# Altium schematic sheet ADC.SchDoc
size A4; SheetNumber: 4; SheetTotal: 5
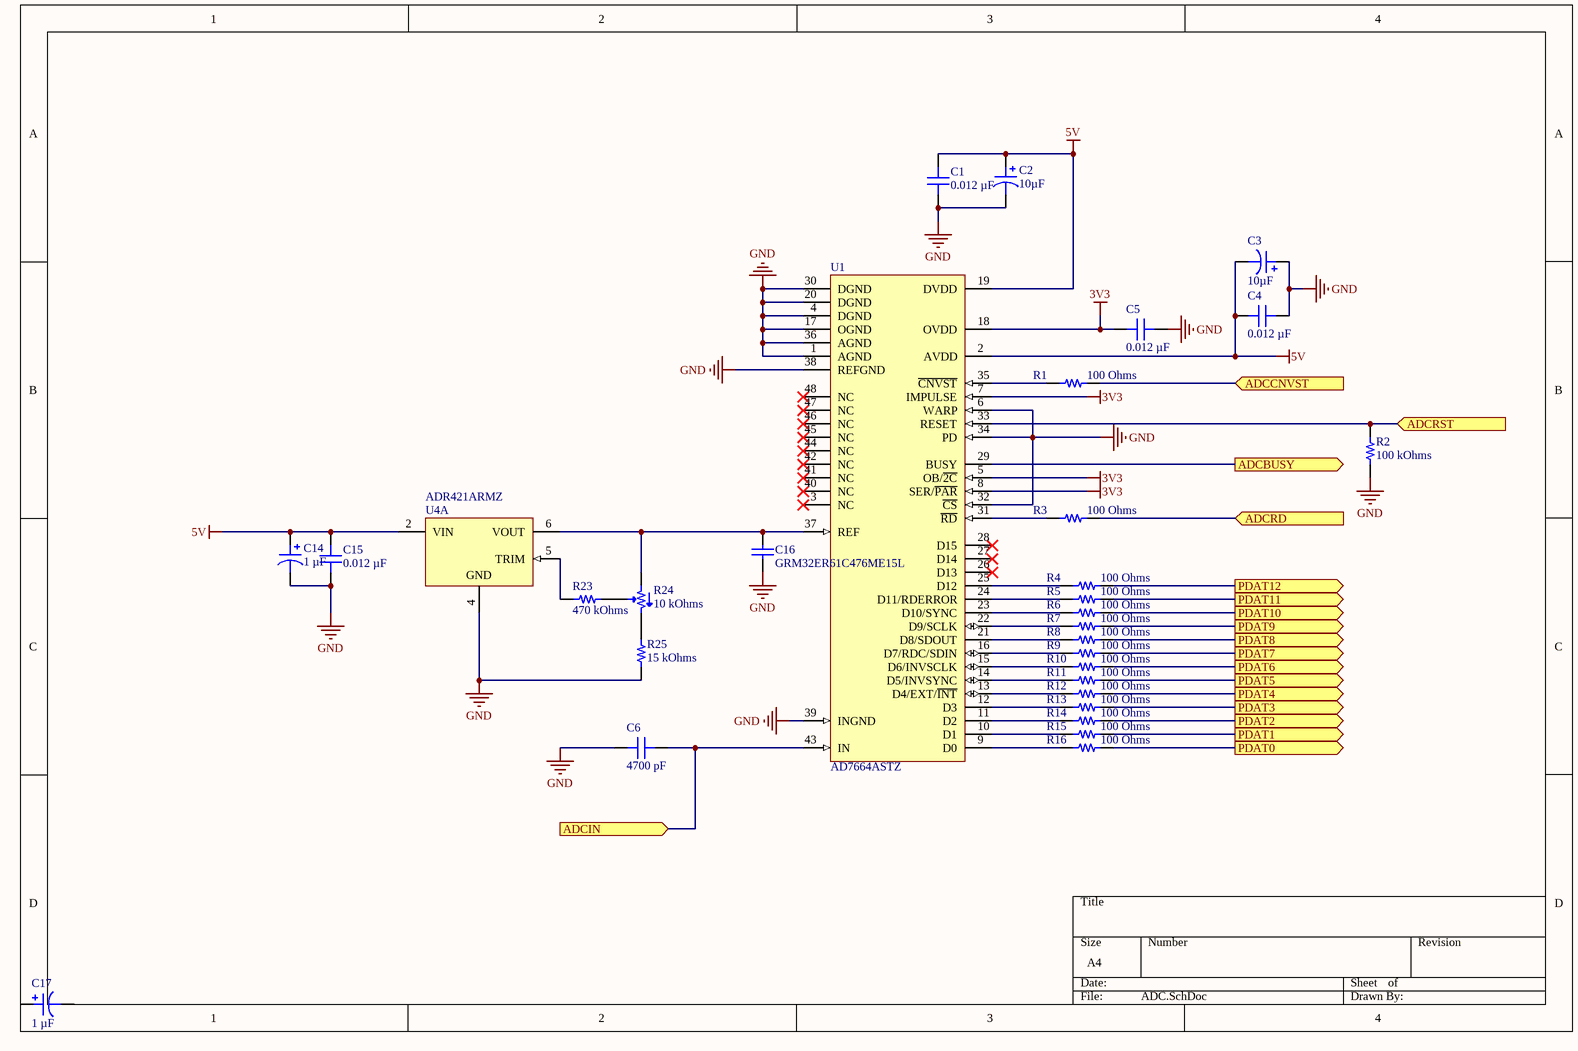
[diagram p0: ADC.SchDoc]

## Parts
C1  0.012 µF  [CAP 0603_1608]
C2  10µF  [CAP ALSMD POLY 4.3MM H5.5MM]
C3  10µF  [CAP ALSMD POLY 4.3MM H5.5MM]
C4  0.012 µF  [CAP 0603_1608]
C5  0.012 µF  [CAP 0603_1608]
C6  4700 pF  [CAP 0603_1608]
C14  1 µF  [CAP ALSMD 4.3MM H5.4MM]
C15  0.012 µF  [CAP 0603_1608]
C16  GRM32ER61C476ME15L  [MURA-1210_H_2.7_M]
C17  1 µF  [CAP ALSMD 4.3MM H5.4MM]
R1  100 Ohms  [RES 0603_1608]
R2  100 kOhms  [RES 0603_1608]
R3  100 Ohms  [RES 0603_1608]
R4  100 Ohms  [RES 0603_1608]
R5  100 Ohms  [RES 0603_1608]
R6  100 Ohms  [RES 0603_1608]
R7  100 Ohms  [RES 0603_1608]
R8  100 Ohms  [RES 0603_1608]
R9  100 Ohms  [RES 0603_1608]
R10  100 Ohms  [RES 0603_1608]
R11  100 Ohms  [RES 0603_1608]
R12  100 Ohms  [RES 0603_1608]
R13  100 Ohms  [RES 0603_1608]
R14  100 Ohms  [RES 0603_1608]
R15  100 Ohms  [RES 0603_1608]
R16  100 Ohms  [RES 0603_1608]
R23  470 kOhms  [RES 0603_1608]
R24  10 kOhms  [POT BOURNS TRIMPOT TC33]
R25  15 kOhms  [RES 0603_1608]
U1  AD7664ASTZ  [ST-48_N]
U4  ADR421ARMZ  [ADI-RM-8_N]  (part A of 2)

## Ports
ADCBUSY (out), ADCCNVST (in), ADCIN (in), ADCRD (in), ADCRST (in), PDAT0 (out), PDAT1 (out), PDAT2 (out), PDAT3 (out), PDAT4 (out), PDAT5 (out), PDAT6 (out), PDAT7 (out), PDAT8 (out), PDAT9 (out), PDAT10 (out), PDAT11 (out), PDAT12 (out)

## Nets
3V3: C5.2 U1.5(OB/~{2C}) U1.7(IMPULSE) U1.8(SER/~{PAR}) U1.18(OVDD)
5V: C1.2 C2.1 C3.2 C4.2 C14.1 C15.2 U1.2(AVDD) U1.19(DVDD) U4.2(VIN)
GND: C1.1 C2.2 C3.1 C4.1 C5.1 C6.1 C14.2 C15.1 C16.1 R2.1 R25.1 U1.1(AGND) U1.4(DGND) U1.6(WARP) U1.17(OGND) U1.20(DGND) U1.30(DGND) U1.32(~{CS}) U1.34(PD) U1.36(AGND) U1.38(REFGND) U1.39(INGND) U4.4(GND)
ADCBUSY: U1.29(BUSY) ; port ADCBUSY
ADCCNVST: R1.2 ; port ADCCNVST
ADCIN: C6.2 U1.43(IN) ; port ADCIN
ADCRD: R3.2 ; port ADCRD
ADCRST: R2.2 U1.33(RESET) ; port ADCRST
PDAT0: R16.2 ; port PDAT0
PDAT1: R15.2 ; port PDAT1
PDAT2: R14.2 ; port PDAT2
PDAT3: R13.2 ; port PDAT3
PDAT4: R12.2 ; port PDAT4
PDAT5: R11.2 ; port PDAT5
PDAT6: R10.2 ; port PDAT6
PDAT7: R9.2 ; port PDAT7
PDAT8: R8.2 ; port PDAT8
PDAT9: R7.2 ; port PDAT9
PDAT10: R6.2 ; port PDAT10
PDAT11: R5.2 ; port PDAT11
PDAT12: R4.2 ; port PDAT12
NetC16_2: C16.2 R24.1 U1.37(REF) U4.6(VOUT)
NetR1_1: R1.1 U1.35(~{CNVST})
NetR3_1: R3.1 U1.31(~{RD})
NetR4_1: R4.1 U1.25(D12)
NetR5_1: R5.1 U1.24(D11/RDERROR)
NetR6_1: R6.1 U1.23(D10/SYNC)
NetR7_1: R7.1 U1.22(D9/SCLK)
NetR8_1: R8.1 U1.21(D8/SDOUT)
NetR9_1: R9.1 U1.16(D7/RDC/SDIN)
NetR10_1: R10.1 U1.15(D6/INVSCLK)
NetR11_1: R11.1 U1.14(D5/INVSYNC)
NetR12_1: R12.1 U1.13(D4/EXT/~{INT})
NetR13_1: R13.1 U1.12(D3)
NetR14_1: R14.1 U1.11(D2)
NetR15_1: R15.1 U1.10(D1)
NetR16_1: R16.1 U1.9(D0)
NetR23_1: R23.1 U4.5(TRIM)
NetR23_2: R23.2 R24.2
NetR24_3: R24.3 R25.2

Not connected (* = marked no-connect by the designer): C17 1 2; U1 3(NC)* 26(D13)* 27(D14)* 28(D15)* 40(NC)* 41(NC)* 42(NC)* 44(NC)* 45(NC)* 46(NC)* 47(NC)* 48(NC)*

## Library data of the parts
C1 C4 C5 C15 = CC0603KRX7R7BB123: CAP CER 0.012UF 16V X7R 0603; manufacturer: Yageo; Tolerance: ±10%; Part Number: CC0603KRX7R7BB123; Value: 0.012 µF; Applications: General Purpose; Capacitance: 0.012 µF; componentlink1description: Datasheet; componentlink1url: https://www.yageo.com/upload/media/product/productsearch/datasheet/mlcc/UPY-GPHC_X7R_6.3V-to-50V_18.pdf; componentlink2description: DigiKey Link; componentlink2url: https://www.digikey.com/en/products/detail/yageo/CC0603KRX7R7BB123/5883754; Device Package: 0603 (1608 Metric); lastupdated: 3/15/2022 3:14:47 AM; Lifecycle Status: Active; Minimum Order: 1; Mounting Type: Surface Mount, MLCC; Operating Temperature: -55°C ~ 125°C; Package / Case: 0603 (1608 Metric); packaging: TapeAndReel; partid: 12340; Part Status: Active; price: 0.01; series: CC; Size / Dimension: 0.063" L x 0.031" W (1.60mm x 0.80mm); Supplier 1: DigiKey; Supplier Part Number 1: 311-3370-1-ND; Temperature Coefficient: X7R; Thickness (Max): 0.035" (0.90mm); Voltage - Rated: 16V
C2 C3 = UWX1C100MCL1GB: CAP ALUM 10UF 20% 16V SMD; manufacturer: Nichicon; Lifetime @ Temp.: 2000 Hrs @ 85°C; Polarization: Polar; Ripple Current @ High Frequency: 34.5mA @ 10kHz; Ripple Current @ Low Frequency: 23mA @ 120Hz; Surface Mount Land Size: 0.169" L x 0.169" W (4.30mm x 4.30mm); Part Number: UWX1C100MCL1GB; Applications: General Purpose; Capacitance: 10µF; componentlink1description: Datasheet; componentlink1url: https://products.nichicon.co.jp/en/pdf/XJA043/e-uwx.pdf; componentlink2description: DigiKey Link; componentlink2url: http://digikey.com/product-detail/en/nichicon/UWX1C100MCL1GB/493-2100-1-ND/590075; Device Package: Radial, Can - SMD; Height - Seated (Max): 0.213" (5.40mm); lastupdated: 9/2/2020 1:23:46 AM; Lifecycle Status: Active; Minimum Order: 1; Mounting Type: Surface Mount; Operating Temperature: -40°C ~ 85°C; Package / Case: Radial, Can - SMD; packaging: TapeAndReel; partid: 7030; Part Status: Active; price: 0.05; series: UWX; Size / Dimension: 0.157" Dia (4.00mm); Supplier 1: DigiKey; Supplier Part Number 1: 493-2100-1-ND; Tolerance: ±20%; value: 10µF; Voltage - Rated: 16V
C6 = CC0603KRX7R7BB472: CAP CER 4700PF 16V X7R 0603; manufacturer: Yageo; Tolerance: ±10%; Part Number: CC0603KRX7R7BB472; Value: 4700 pF; Applications: General Purpose; Capacitance: 4700 pF; componentlink1description: Datasheet; componentlink1url: https://www.yageo.com/upload/media/product/productsearch/datasheet/mlcc/UPY-GPHC_X7R_6.3V-to-50V_18.pdf; componentlink2description: DigiKey Link; componentlink2url: https://www.digikey.com/en/products/detail/yageo/CC0603KRX7R7BB472/5883766; Device Package: 0603 (1608 Metric); lastupdated: 3/15/2022 3:14:35 AM; Lifecycle Status: Active; Minimum Order: 1; Mounting Type: Surface Mount, MLCC; Operating Temperature: -55°C ~ 125°C; Package / Case: 0603 (1608 Metric); packaging: TapeAndReel; partid: 15797; Part Status: Active; price: 0.01; series: CC; Size / Dimension: 0.063" L x 0.031" W (1.60mm x 0.80mm); Supplier 1: DigiKey; Supplier Part Number 1: 311-4074-1-ND; Temperature Coefficient: X7R; Thickness (Max): 0.035" (0.90mm); Voltage - Rated: 16V
C14 C17 = EEE-FC1V1R0R: CAP ALUM 1UF 20% 35V SMD; manufacturer: Panasonic Electronic Components; Impedance: 3 Ohms; Lifetime @ Temp.: 1000 Hrs @ 105°C; Polarization: Polar; Ripple Current @ High Frequency: 60 mA @ 100 kHz; Ripple Current @ Low Frequency: 45 mA @ 120 Hz; Surface Mount Land Size: 0.169" L x 0.169" W (4.30mm x 4.30mm); Part Number: EEE-FC1V1R0R; Applications: Automotive; Capacitance: 1 µF; componentlink1description: Datasheet; componentlink1url: https://industrial.panasonic.com/cdbs/www-data/pdf/RDE0000/ABA0000C1172.pdf; componentlink2description: DigiKey Link; componentlink2url: https://www.digikey.com/en/products/detail/panasonic-electronic-components/EEE-FC1V1R0R/817433; Device Package: Radial, Can - SMD; Height - Seated (Max): 0.213" (5.40mm); lastupdated: 3/15/2022 3:52:45 AM; Lifecycle Status: Active; Minimum Order: 1; Mounting Type: Surface Mount; Operating Temperature: -40°C ~ 105°C; Package / Case: Radial, Can - SMD; packaging: TapeAndReel; partid: 7113; Part Status: Active; price: 0.10; Ratings: AEC-Q200; series: FC; Size / Dimension: 0.157" Dia (4.00mm); Supplier 1: DigiKey; Supplier Part Number 1: PCE4024CT-ND; Tolerance: ±20%; value: 1 µF; Voltage - Rated: 35 V
C16 = CMP-2000-05260-1: CAP, Ceramic, 47 uF, 20%, 16 V, 1210, RoHS, Tape and Reel; Manufacturer: Murata; Case Length: 3.2mm; Brand: MurataElectronics; Capacitance: 47uF; Dielectric: X5R; Type: GeneralPurposeMLCC; Case Width: 2.5mm; Voltage Rating DC: 16V; Case Code - in: 1210; Datasheet Version: Aug-14; Manufacturer URL: http://www.murata.com/; Package Description: 2-Pin Surface Mount Device, Body 3.2 x 2.5 mm; Series: GRM; Minimum Operating Temperature: -55C; Package / Case: 1210(3225metric); Termination Style: SMD/SMT; Packaging: Reel; Product: GeneralTypeMLCCs; RoHS: Details; Package Reference: 1210; Case Code - mm: 3225; Datasheet URL: https://datasheet.ciiva.com/3777/2723grm32er61c476me1523-3777296.pdf; Product Category: MultilayerCeramicCapacitorsMLCC-SMD/SMT; Maximum Operating Temperature: +85C; Case Height: 2.5mm; Tolerance: 20%; Factory Pack Quantity: 1000
R1 R3-R16 = WR06X101 JTL: RES 100 OHM 5% 1/10W 0603; Manufacturer: Walsin Technology Corporation; Power (Watts): 0.1W, 1/10W; Temperature Coefficient: ±100ppm/°C; Part Number: WR06X101 JTL; Value: 100 Ohms; ComponentLink1Description: Datasheet; ComponentLink1URL: https://www.passivecomponent.com/wp-content/uploads/chipR/ASC_WR.pdf; ComponentLink2Description: DigiKey Link; ComponentLink2URL: https://www.digikey.com/en/products/detail/walsin-technology-corporation/WR06X101-JTL/13241290; Composition: Thick Film; Device Package: 0603 (1608 Metric); Height - Seated (Max): 0.024" (0.60mm); LastUpdated: 3/11/2022 5:43:32 AM; Lifecycle Status: Active; Minimum Order: 1; Number of Terminations: 2; Operating Temperature: -55°C ~ 155°C; Package / Case: 0603 (1608 Metric); Packaging: CutTape; PartId: 62337; Part Status: Active; Price: 0.01; Resistance: 100 Ohms; Series: WR; Size / Dimension: 0.063" L x 0.031" W (1.60mm x 0.80mm); Supplier 1: DigiKey; Supplier Part Number 1: 1292-WR06X101JTLCT-ND; Supplier Device Package: 0603; Tolerance: ±5%
R2 = RNCS0603BKE100K: RES 100K OHM 0.1% 1/16W 0603; Manufacturer: Stackpole Electronics Inc; Power (Watts): 0.063W, 1/16W; Temperature Coefficient: ±25ppm/°C; Part Number: RNCS0603BKE100K; Value: 100 kOhms; ComponentLink1Description: Datasheet; ComponentLink1URL: https://www.seielect.com/catalog/sei-rncs_rnch.pdf; ComponentLink2Description: DigiKey Link; ComponentLink2URL: https://www.digikey.com/en/products/detail/stackpole-electronics-inc/RNCS0603BKE100K/1708835; Composition: Thin Film; Device Package: 0603 (1608 Metric); Features: Anti-Corrosive, Automotive AEC-Q200, Moisture Resistant; Height - Seated (Max): 0.022" (0.55mm); LastUpdated: 3/15/2022 3:33:57 AM; Lifecycle Status: Active; Minimum Order: 1; Number of Terminations: 2; Operating Temperature: -55°C ~ 155°C; Package / Case: 0603 (1608 Metric); Packaging: TapeAndReel; PartId: 4849; Part Status: Active; Price: 0.08; Ratings: AEC-Q200; Resistance: 100 kOhms; Series: RNCS; Size / Dimension: 0.061" L x 0.031" W (1.55mm x 0.80mm); Supplier 1: DigiKey; Supplier Part Number 1: RNCS0603BKE100KCT-ND; Supplier Device Package: 0603; Tolerance: ±0.1%
R23 = RS73G1JTTD4703B: RES 470K OHM 0.1% 1/5W 0603; Manufacturer: KOA Speer Electronics, Inc.; Power (Watts): 0.2W, 1/5W; Temperature Coefficient: ±50ppm/°C; Part Number: RS73G1JTTD4703B; Value: 470 kOhms; ComponentLink1Description: Datasheet; ComponentLink1URL: http://www.koaspeer.com/pdfs/RS73.pdf; ComponentLink2Description: DigiKey Link; ComponentLink2URL: https://www.digikey.com/en/products/detail/koa-speer-electronics-inc/RS73G1JTTD4703B/11594392; Composition: Thick Film; Device Package: 0603 (1608 Metric); Features: Automotive AEC-Q200, Moisture Resistant; Height - Seated (Max): 0.022" (0.55mm); LastUpdated: 3/15/2022 3:32:04 AM; Lifecycle Status: Active; Minimum Order: 1; Number of Terminations: 2; Operating Temperature: -55°C ~ 155°C; Package / Case: 0603 (1608 Metric); Packaging: TapeAndReel; PartId: 56379; Part Status: Active; Price: 0.09; Ratings: AEC-Q200; Resistance: 470 kOhms; Series: RS73; Size / Dimension: 0.063" L x 0.031" W (1.60mm x 0.80mm); Supplier 1: DigiKey; Supplier Part Number 1: 2019-RS73G1JTTD4703BCT-ND; Supplier Device Package: 0603; Tolerance: ±0.1%
R24 = TC33X-2-103E: TRIMMER 10K OHM 0.1W J LEAD TOP; Manufacturer: Bourns Inc.; Adjustment Type: Top Adjustment; Number of Turns: 1; Power (Watts): 0.1W, 1/10W; Resistive Material: Cermet; Temperature Coefficient: ±250ppm/°C; Tolerance: ±25%; Part Number: TC33X-2-103E; ComponentLink1Description: Datasheet; ComponentLink1URL: https://www.bourns.com/docs/Product-Datasheets/TC33.pdf; ComponentLink2Description: DigiKey Link; ComponentLink2URL: http://digikey.com/product-detail/en/bourns-inc/TC33X-2-103E/TC33X-103ECT-ND/612911; LastUpdated: 3/15/2022 3:57:53 AM; Lifecycle Status: Active; Minimum Order: 1; Mounting Type: Surface Mount; Packaging: TapeAndReel; PartId: 8; Part Status: Active; Price: 0.15; Resistance: 10 kOhms; Series: Trimpot® TC33 - Open Frame; Size / Dimension: Rectangular - 0.150" x 0.142" Face x 0.047" H (3.80mm x 3.60mm x 1.20mm); Supplier 1: DigiKey; Supplier Part Number 1: TC33X-103ECT-ND; Termination Style: J Lead; Value: 10 kOhms
R25 = ERA-3VRW1502V: RES 15K OHM 0.05% 1/8W 0603; Manufacturer: Panasonic Electronic Components; Power (Watts): 0.125W, 1/8W; Temperature Coefficient: ±10ppm/°C; Part Number: ERA-3VRW1502V; Value: 15 kOhms; ComponentLink1Description: Datasheet; ComponentLink1URL: https://b2b-api.panasonic.eu/file_stream/pids/fileversion/9152; ComponentLink2Description: DigiKey Link; ComponentLink2URL: https://www.digikey.com/en/products/detail/panasonic-electronic-components/ERA-3VRW1502V/12086623; Composition: Thin Film; Device Package: 0603 (1608 Metric); Features: Anti-Sulfur, Automotive AEC-Q200; Height - Seated (Max): 0.022" (0.55mm); LastUpdated: 3/15/2022 3:31:55 AM; Lifecycle Status: Active; Minimum Order: 1; Number of Terminations: 2; Operating Temperature: -55°C ~ 155°C; Package / Case: 0603 (1608 Metric); Packaging: TapeAndReel; PartId: 63285; Part Status: Active; Price: 0.22; Ratings: AEC-Q200; Resistance: 15 kOhms; Series: ERA-3V; Size / Dimension: 0.063" L x 0.031" W (1.60mm x 0.80mm); Supplier 1: DigiKey; Supplier Part Number 1: 10-ERA-3VRW1502VCT-ND; Supplier Device Package: 0603; Tolerance: ±0.05%
U1 = CMP-0313-00850-2: Single 16-Bit PulSAR Analog-to-Digital Converter with Parallel, Serial, SPI Interface, Unipolar CMOS, 570KSPS, -40 to +85 degC, ST-48, Pb-Free, Tray; Generic Part Number: AD7664; Manufacturer: Analog Devices; Throughput Rate (SPS): 570K; Resolution (Bits): 16; Interface: Par, Ser, SPI; Channels: 1; ComponentLink4URL: http://www.analog.com/en/analog-to-digital-converters/ad-converters/ad7664/products/product.html; ComponentLink2Description: Datasheet; RoHS: Y; ComponentLink3Description: Package Specification; PackageVersion: revA; ComponentLink2URL: http://www.analog.com/static/imported-files/data_sheets/AD7664.pdf; Mounting Technology: Surface Mount; DatasheetVersion: Rev.E; PackageDescription: 48-Pin Thin Quad Flat Pack 0.5 mm Pitch; ComponentLink1URL: http://www.analog.com/en/index.html; ComponentLink3URL: http://www.analog.com/static/imported-files/packages/PKG_PDF/LQFP%28ST%29/ST_48.pdf; ComponentLink4Description: Product URL; ComponentLink1Description: Manufacturer URL; PackageReference: ST-48; PartNumber: AD7664ASTZ; Packing: Tray
U4 = CMP-0784-00399-1: Ultraprecision, Low Noise, XFET(R) Voltage Reference, 2.5 V Output, 4.5 to 18 V Supply, Industrial, 8-pin SOP (RM-8), Tube; Manufacturer: Analog Devices; Ref Out TC (ppm/C): 2; Vout: 2.5V; Min V Supply (V): 4.5; Max V Supply (V): 18; Code_JEDEC: MO-187-AA; ComponentLink3Description: Package Specification; PackageReference: RM-8; PackageVersion: Aug-05; PackageDescription: 8-Pin Mini Small Outline Package, Body 3 x 3 mm, Pitch 0.65 mm; Mounting Technology: Surface Mount; ComponentLink4URL: Product URL:http://www.analog.com/en/special-linear-functions/voltage-references/adr421/products/product.html; PartNumber: ADR421ARMZ; ComponentLink1Description: Manufacturer URL; ComponentLink1URL: http://www.analog.com/en/index.html; ComponentLink4Description: URL Link1; Operating Temp Range: -40 to 125 degC; DatasheetVersion: Rev. I; ComponentLink2Description: Datasheet; ComponentLink3URL: http://www.analog.com/static/imported-files/packages/PKG_PDF/MSOP%28RM%29/RM_8.pdf; ComponentLink2URL: http://www.analog.com/static/imported-files/data_sheets/ADR420_421_423_425.pdf; Packing: Tube